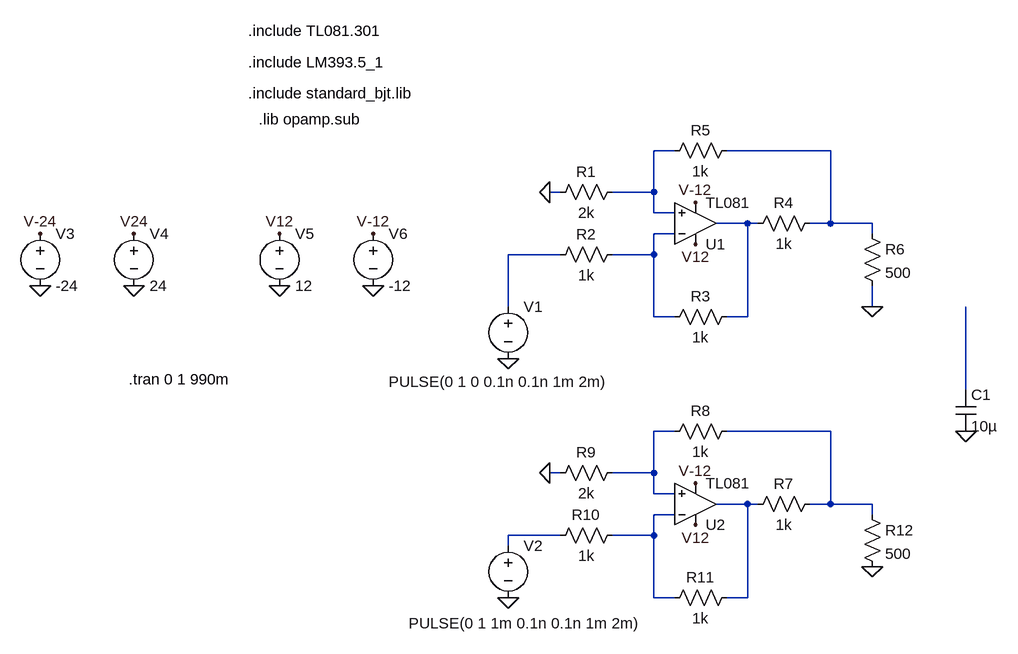
[diagram p0: schematic Fuentes_salida_flipflop_v2_Howland.asc]
Fuentes_salida_flipflop_v2_Howland.asc, the LTspice schematic file:
Version 4
SHEET 1 1304 908
WIRE 272 -80 240 -80
WIRE 512 -80 352 -80
WIRE 96 -16 80 -16
WIRE 240 -16 240 -80
WIRE 240 -16 176 -16
WIRE 240 16 240 -16
WIRE 272 16 240 16
WIRE 384 32 336 32
WIRE 400 32 384 32
WIRE 512 32 512 -80
WIRE 512 32 480 32
WIRE 576 32 512 32
WIRE 272 48 240 48
WIRE 576 48 576 32
WIRE 96 80 16 80
WIRE 240 80 240 48
WIRE 240 80 176 80
WIRE 16 160 16 80
WIRE 576 160 576 128
WIRE 240 176 240 80
WIRE 272 176 240 176
WIRE 384 176 384 32
WIRE 384 176 352 176
WIRE 720 288 720 160
WIRE 272 352 240 352
WIRE 512 352 352 352
WIRE 96 416 80 416
WIRE 240 416 240 352
WIRE 240 416 176 416
WIRE 240 448 240 416
WIRE 272 448 240 448
WIRE 384 464 336 464
WIRE 400 464 384 464
WIRE 512 464 512 352
WIRE 512 464 480 464
WIRE 576 464 512 464
WIRE 272 480 240 480
WIRE 576 480 576 464
WIRE 96 512 16 512
WIRE 240 512 240 480
WIRE 240 512 176 512
WIRE 16 528 16 512
WIRE 240 608 240 512
WIRE 272 608 240 608
WIRE 384 608 384 464
WIRE 384 608 352 608
FLAG 720 352 0
FLAG 304 64 V12
FLAG 16 608 0
FLAG 16 240 0
FLAG -704 128 0
FLAG -560 128 0
FLAG -704 48 V-24
FLAG -560 48 V24
FLAG -336 128 0
FLAG -336 48 V12
FLAG 80 -16 0
FLAG 304 496 V12
FLAG 80 416 0
FLAG 576 560 0
FLAG -192 128 0
FLAG -192 48 V-12
FLAG 304 0 V-12
FLAG 304 432 V-12
FLAG 576 160 0
SYMBOL cap 704 288 R0
SYMATTR InstName C1
SYMATTR Value 10µ
SYMBOL Opamps\\opamp2 304 96 M180
SYMATTR InstName U1
SYMATTR Value TL081
SYMBOL voltage 16 144 R0
WINDOW 123 0 0 Left 0
WINDOW 39 0 0 Left 0
WINDOW 3 -184 132 Left 2
SYMATTR Value PULSE(0 1 0 0.1n 0.1n 1m 2m)
SYMATTR InstName V1
SYMBOL voltage 16 512 R0
WINDOW 123 0 0 Left 0
WINDOW 39 0 0 Left 0
WINDOW 3 -153 135 Left 2
SYMATTR Value PULSE(0 1 1m 0.1n 0.1n 1m 2m)
SYMATTR InstName V2
SYMBOL voltage -704 32 R0
WINDOW 123 0 0 Left 0
WINDOW 39 0 0 Left 0
SYMATTR InstName V3
SYMATTR Value -24
SYMBOL voltage -560 32 R0
WINDOW 123 0 0 Left 0
WINDOW 39 0 0 Left 0
SYMATTR InstName V4
SYMATTR Value 24
SYMBOL voltage -336 32 R0
WINDOW 123 0 0 Left 0
WINDOW 39 0 0 Left 0
SYMATTR InstName V5
SYMATTR Value 12
SYMBOL res 496 16 R90
WINDOW 0 0 56 VBottom 2
WINDOW 3 32 56 VTop 2
SYMATTR InstName R4
SYMATTR Value 1k
SYMBOL res 368 -96 R90
WINDOW 0 0 56 VBottom 2
WINDOW 3 32 56 VTop 2
SYMATTR InstName R5
SYMATTR Value 1k
SYMBOL res 192 -32 R90
WINDOW 0 0 56 VBottom 2
WINDOW 3 32 56 VTop 2
SYMATTR InstName R1
SYMATTR Value 2k
SYMBOL res 192 64 R90
WINDOW 0 0 56 VBottom 2
WINDOW 3 32 56 VTop 2
SYMATTR InstName R2
SYMATTR Value 1k
SYMBOL res 368 160 R90
WINDOW 0 0 56 VBottom 2
WINDOW 3 32 56 VTop 2
SYMATTR InstName R3
SYMATTR Value 1k
SYMBOL res 560 32 R0
SYMATTR InstName R6
SYMATTR Value 500
SYMBOL Opamps\\opamp2 304 528 M180
SYMATTR InstName U2
SYMATTR Value TL081
SYMBOL res 496 448 R90
WINDOW 0 0 56 VBottom 2
WINDOW 3 32 56 VTop 2
SYMATTR InstName R7
SYMATTR Value 1k
SYMBOL res 368 336 R90
WINDOW 0 0 56 VBottom 2
WINDOW 3 32 56 VTop 2
SYMATTR InstName R8
SYMATTR Value 1k
SYMBOL res 192 400 R90
WINDOW 0 0 56 VBottom 2
WINDOW 3 32 56 VTop 2
SYMATTR InstName R9
SYMATTR Value 2k
SYMBOL res 192 496 R90
WINDOW 0 0 56 VBottom 2
WINDOW 3 32 56 VTop 2
SYMATTR InstName R10
SYMATTR Value 1k
SYMBOL res 368 592 R90
WINDOW 0 0 56 VBottom 2
WINDOW 3 32 56 VTop 2
SYMATTR InstName R11
SYMATTR Value 1k
SYMBOL res 560 464 R0
SYMATTR InstName R12
SYMATTR Value 500
SYMBOL voltage -192 32 R0
WINDOW 123 0 0 Left 0
WINDOW 39 0 0 Left 0
SYMATTR InstName V6
SYMATTR Value -12
TEXT -568 272 Left 2 !.tran 0 1 990m
TEXT -384 -168 Left 2 !.include standard_bjt.lib
TEXT -384 -216 Left 2 !.include LM393.5_1
TEXT -384 -264 Left 2 !.include TL081.301
TEXT -368 -128 Left 2 !.lib opamp.sub

The netlist it stands for:
* Fuentes_salida_flipflop_v2_Howland.asc
C1 N006 0 10µ
XU1 N001 N004 V12 V-12 N003 TL081  ; pins In+ In- V+ V- OUT
V1 N005 0 PULSE(0 1 0 0.1n 0.1n 1m 2m)
V2 N011 0 PULSE(0 1 1m 0.1n 0.1n 1m 2m)
V3 V-24 0 -24
V4 V24 0 24
V5 V12 0 12
R4 N002 N003 1k
R5 N002 N001 1k
R1 N001 0 2k
R2 N004 N005 1k
R3 N003 N004 1k
R6 N002 0 500
XU2 N007 N010 V12 V-12 N009 TL081  ; pins In+ In- V+ V- OUT
R7 N008 N009 1k
R8 N008 N007 1k
R9 N007 0 2k
R10 N010 N011 1k
R11 N009 N010 1k
R12 N008 0 500
V6 V-12 0 -12
.tran 0 1 990m
.include standard_bjt.lib
.include LM393.5_1
.include TL081.301
.lib opamp.sub
.backanno
.end